# EAGLE design touch_brick (EAGLE 7.2.0)
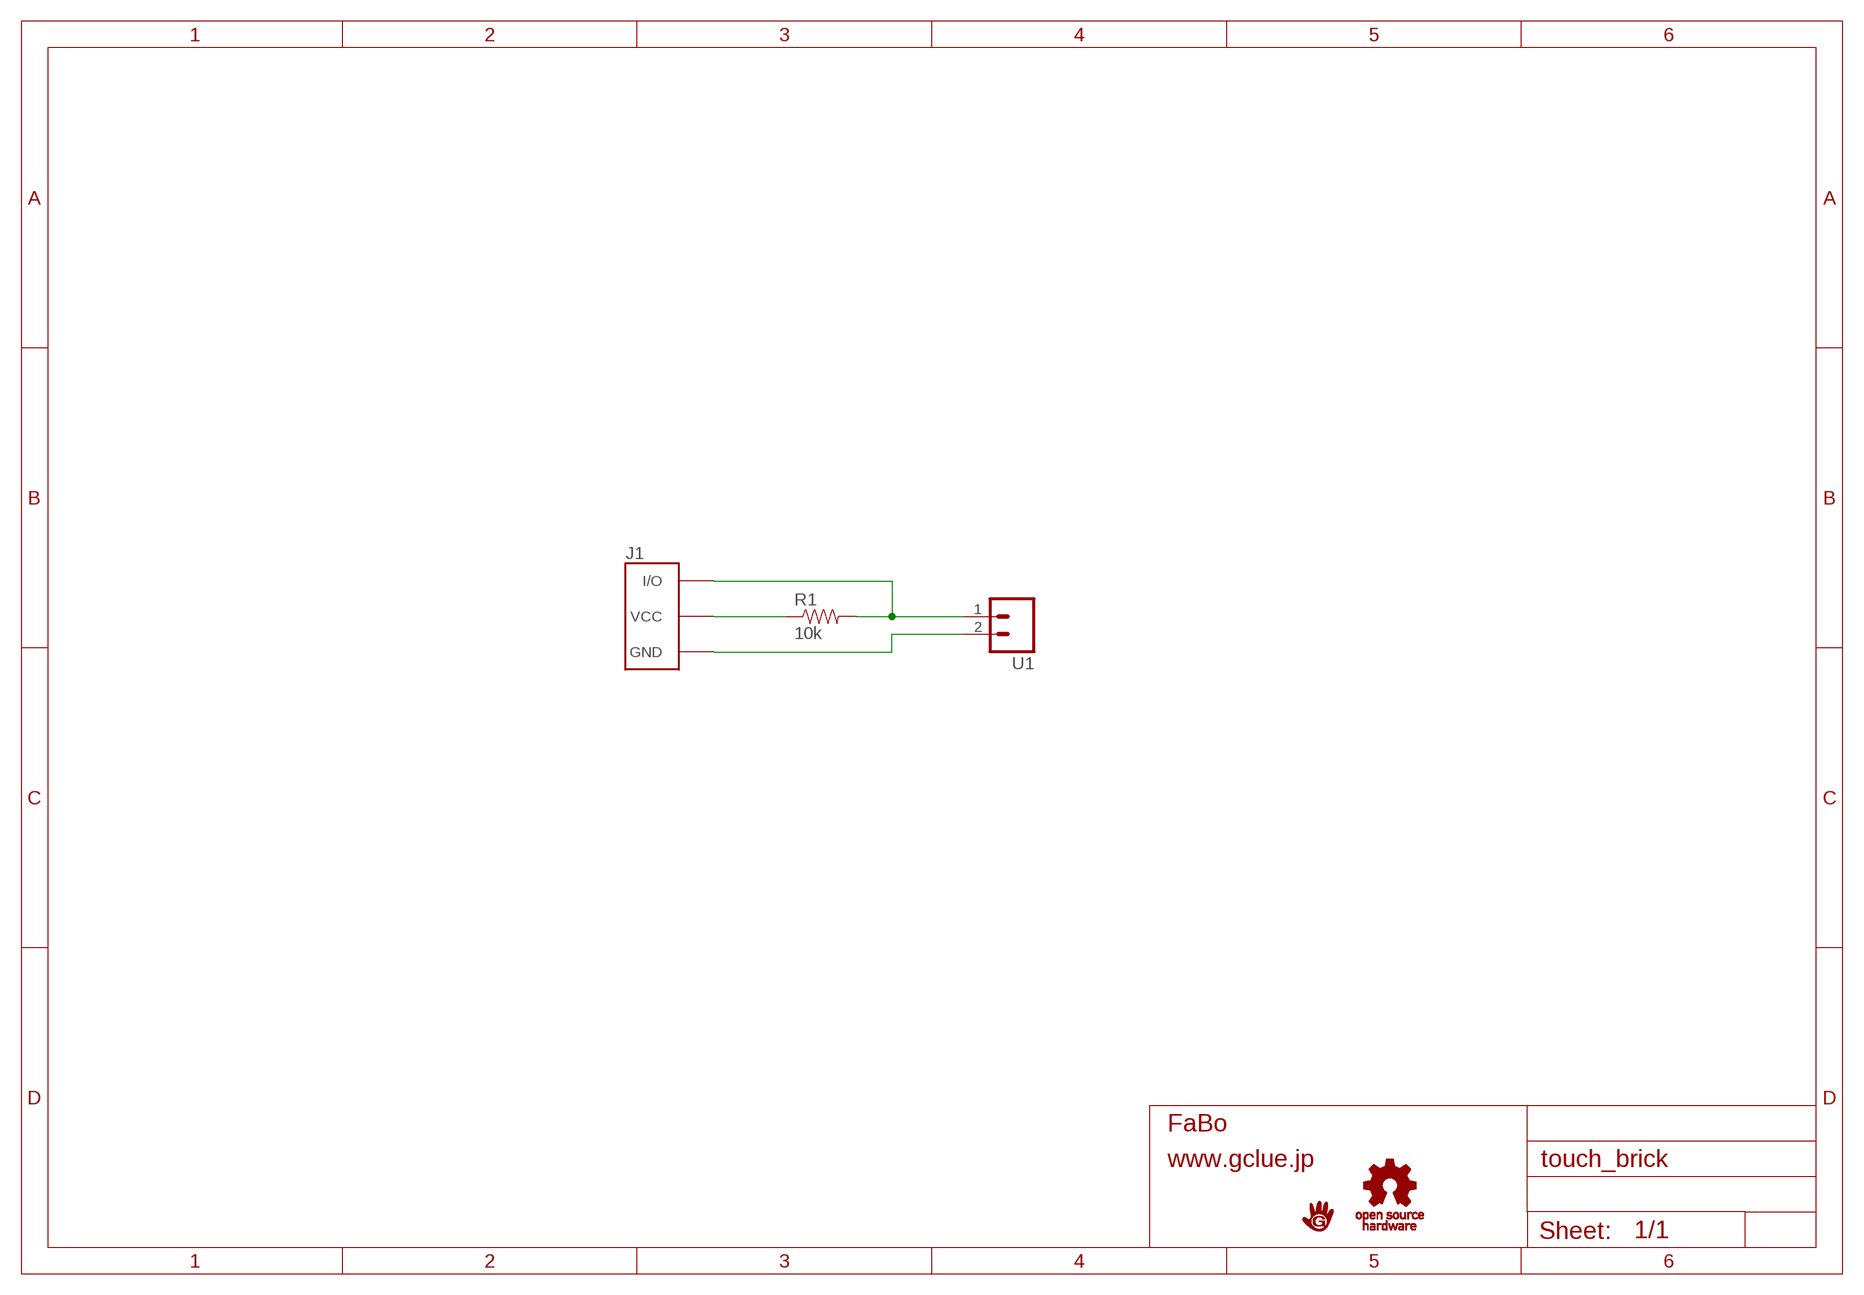
[diagram p0: schematic, sheet 1]

## Parts
J1  BRICK_3PIN  [BRICK_3PIN]
R1  10k  RESISTORPTH-1/4W  [AXIAL-0.4]
U1  M02LOCK  [1X02_LOCK]
U$2  LOGO_GCLUE-M  [LOGO_GCLUE_M]
U$3  LOGO_OSHW_T-M  [LOGO_OSHW_T_M]

## Nets
GND: J1.GND U1.2
N$1: J1.IN/OUT(I/O) R1.P$2 U1.1
N$2: J1.VCC R1.P$1

## Library data of the parts
J1 = Gclue:BRICK_3PIN: FaBo Brick 3pin
R1 = SparkFun-Resistors:RESISTOR: Resistor Basic schematic elements and footprints for 0603, 1206, and PTH resistors.
U1 = SparkFun:M02: Header 2 Standard 2-pin 0.1" header. Use with straight break away headers (SKU : PRT-00116), right angle break away headers (PRT-00553), swiss pins (PRT-00743), machine pins (PRT-00117), and female headers (PRT-00115). Molex polarized connector foot print use with SKU : PRT-08233 with associated crimp pins and housings.
U$2 = Gclue:LOGO_GCLUE
U$3 = Gclue:LOGO_OSHW_T

## Board
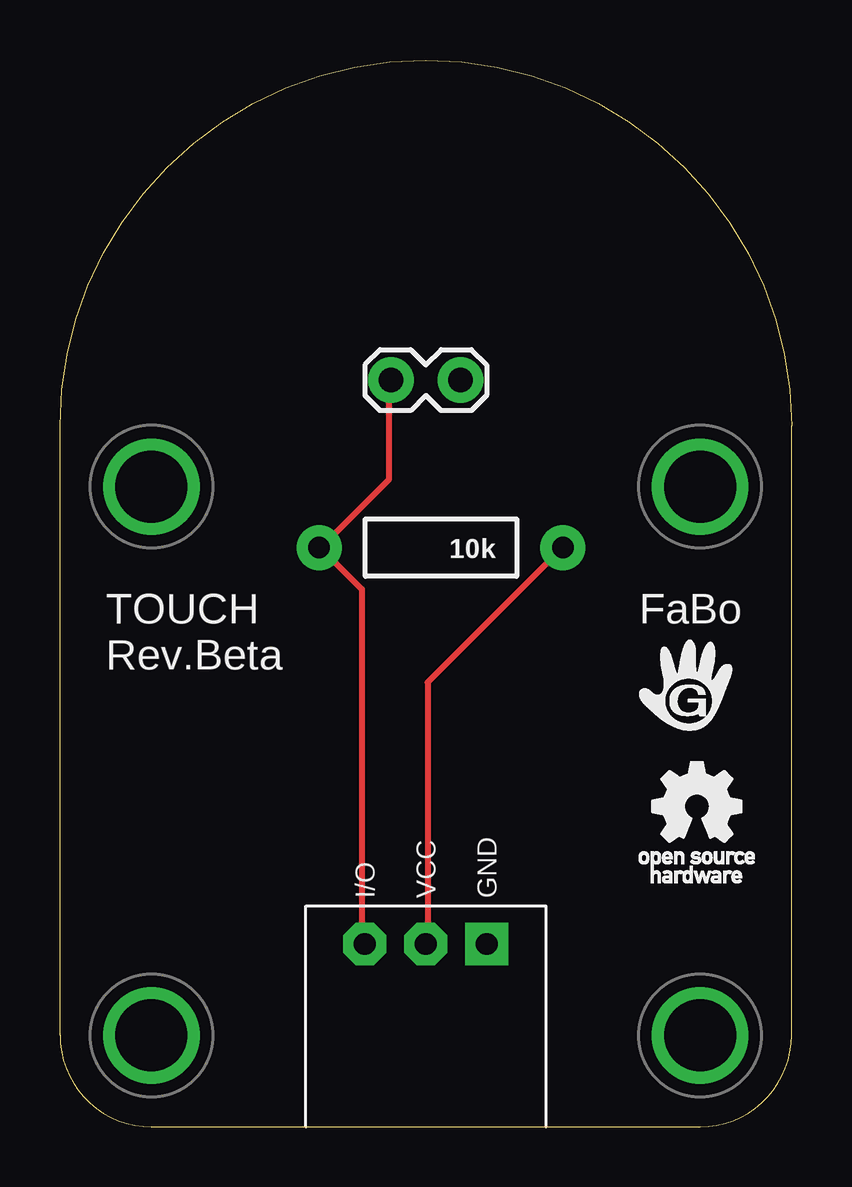
[diagram p1: board, top side]
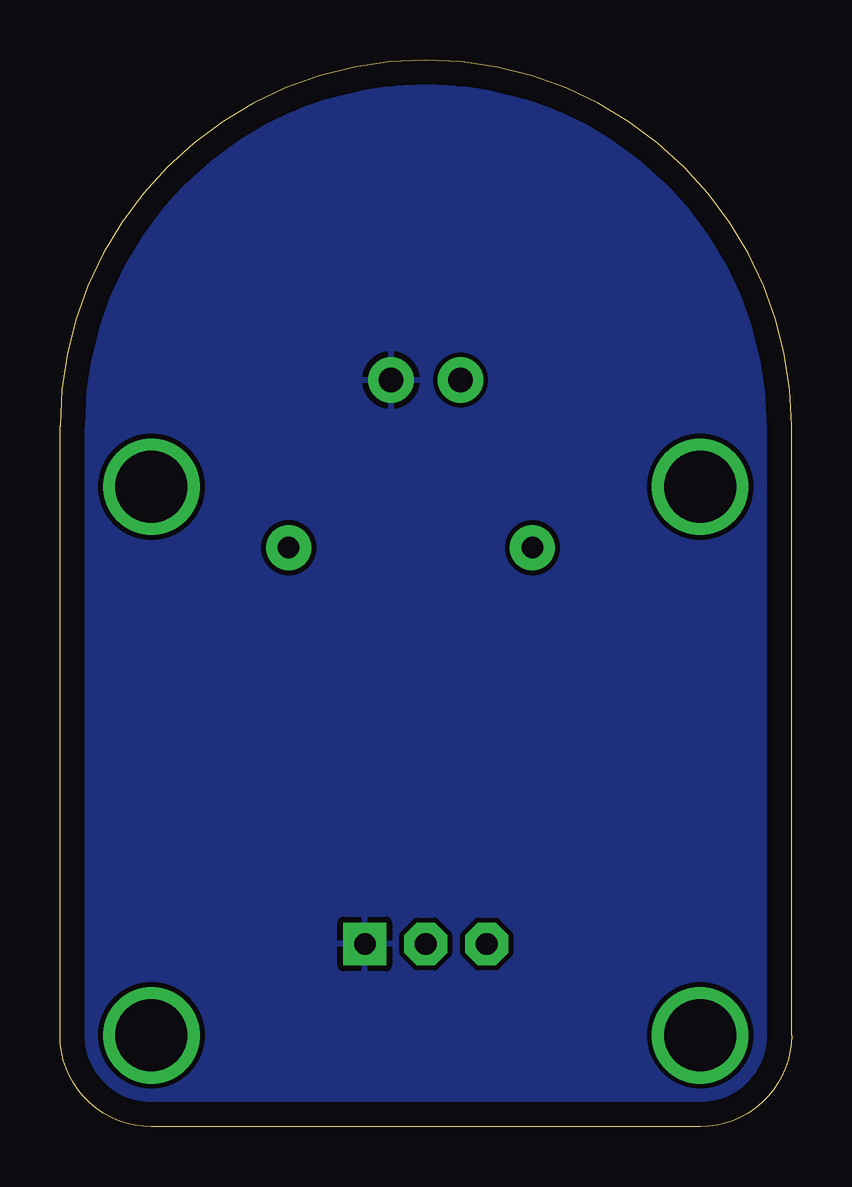
[diagram p2: board, bottom side, seen from below]

Size 30.48 x 44.45 mm. Coordinates in mm from the lower left corner, seen from the top.
Copper layers (1*16): Top 0.035mm / dielectric 1.5mm / Bottom 0.035mm
Design rules "default": minimum track width 10mil, minimum drill 24mil, track to track 8mil, track to pad 8mil, pad to pad 8mil, via to via 8mil, smd to smd 8mil, copper to edge 40mil, drill to drill 8mil, minimum pad ring 10mil, minimum via ring 8mil, stop-mask expansion 4mil, vias tented up to drill 0mil, thermal gap 10mil

### Footprints (pad centres in the part's own frame; a part is rotated, then mirrored left to right if it is on the bottom)
BRICK_3PIN = drill 0.9 pad 1.778 square: GND 2.54,-11.43 | drill 0.9 pad 1.778 octagon: IN/OUT -2.54,-11.43; VCC 0,-11.43 | drill 3 pad 3.81: P$1 -11.43,7.62; P$2 11.43,7.62; P$3 11.43,-15.24; P$4 -11.43,-15.24
AXIAL-0.4 = drill 0.9 pad 1.88: P$1 -5.08,0; P$2 5.08,0
1X02_LOCK = drill 1.016 pad 1.88: 1 -0.178,0; 2 2.718,0

### Placement (x,y rotation side)
J1  15.24,19.05 0 top
R1  15.88,24.13 180 top
U1  13.97,31.11 0 top
U$2  26.04,18.41 0 top
U$3  26.67,12.7 0 top

### Tracks (layer width: path | path; a pad name or v marks a point on that pad's centre or on a via)
GND
  pour Bottom: 0,0 30.48,0 29.84,44.45 -0.64,44.45
N$1
  Top 0.254: J1.IN/OUT 12.57,7.77 12.57,22.4 10.97,24 R1.P$2 10.97,24.23 13.72,26.98 13.72,31.09 U1.1
N$2
  Top 0.254: J1.VCC 15.32,7.77 15.32,18.52 20.8,24 R1.P$1

### Text on the board
tPlace: FaBo | TOUCH / Rev.Beta